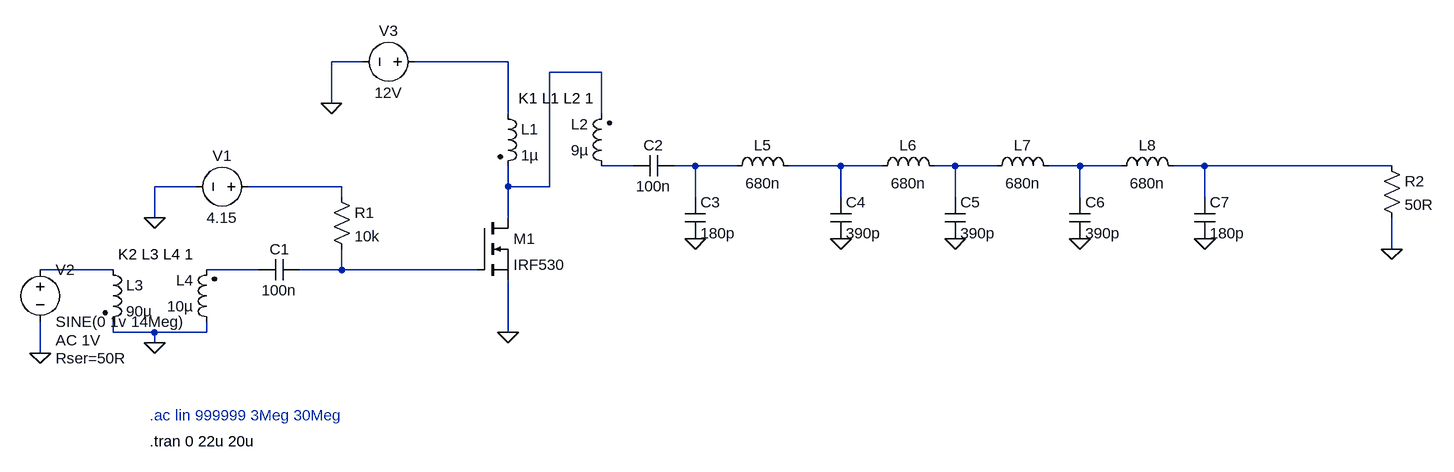
[diagram p0: schematic OUT_RF_AMP.asc]
OUT_RF_AMP.asc, the LTspice schematic file:
Version 4
SHEET 1 2644 680
WIRE -240 -352 -288 -352
WIRE -16 -352 -160 -352
WIRE 128 -336 48 -336
WIRE -288 -288 -288 -352
WIRE -16 -272 -16 -352
WIRE 128 -272 128 -336
WIRE 176 -192 128 -192
WIRE 272 -192 240 -192
WIRE 336 -192 272 -192
WIRE 496 -192 416 -192
WIRE 560 -192 496 -192
WIRE 672 -192 640 -192
WIRE 736 -192 672 -192
WIRE 864 -192 816 -192
WIRE 928 -192 864 -192
WIRE 1056 -192 1008 -192
WIRE 1344 -192 1056 -192
WIRE -496 -160 -560 -160
WIRE -272 -160 -416 -160
WIRE -16 -160 -16 -192
WIRE 48 -160 48 -336
WIRE 48 -160 -16 -160
WIRE -272 -144 -272 -160
WIRE 272 -144 272 -192
WIRE 496 -144 496 -192
WIRE 672 -144 672 -192
WIRE 864 -144 864 -192
WIRE 1056 -144 1056 -192
WIRE -560 -112 -560 -160
WIRE -16 -112 -16 -160
WIRE 1344 -64 1344 -112
WIRE -624 -32 -736 -32
WIRE -400 -32 -480 -32
WIRE -272 -32 -272 -64
WIRE -272 -32 -336 -32
WIRE -64 -32 -272 -32
WIRE -624 64 -624 48
WIRE -560 64 -624 64
WIRE -480 64 -480 48
WIRE -480 64 -560 64
WIRE -16 64 -16 -16
WIRE -560 80 -560 64
WIRE -736 96 -736 48
FLAG -16 64 0
FLAG -560 -112 0
FLAG -288 -288 0
FLAG -560 80 0
FLAG 1344 -64 0
FLAG 272 -80 0
FLAG 496 -80 0
FLAG 672 -80 0
FLAG 864 -80 0
FLAG 1056 -80 0
FLAG -736 96 0
SYMBOL nmos -64 -112 R0
SYMATTR InstName M1
SYMATTR Value IRF530
SYMBOL cap -336 -48 R90
WINDOW 0 0 32 VBottom 2
WINDOW 3 32 32 VTop 2
SYMATTR InstName C1
SYMATTR Value 100n
SYMBOL res -288 -160 R0
SYMATTR InstName R1
SYMATTR Value 10k
SYMBOL voltage -400 -160 R90
WINDOW 0 -32 56 VBottom 2
WINDOW 3 32 56 VTop 2
WINDOW 123 0 0 Left 0
WINDOW 39 0 0 Left 0
SYMATTR InstName V1
SYMATTR Value 4.15
SYMBOL ind2 -32 -288 R0
SYMATTR InstName L1
SYMATTR Value 1µ
SYMATTR Type ind
SYMBOL voltage -144 -352 R90
WINDOW 0 -32 56 VBottom 2
WINDOW 3 32 56 VTop 2
WINDOW 123 0 0 Left 0
WINDOW 39 0 0 Left 0
SYMATTR InstName V3
SYMATTR Value 12V
SYMBOL ind2 144 -176 R180
WINDOW 0 36 80 Left 2
WINDOW 3 36 40 Left 2
SYMATTR InstName L2
SYMATTR Value 9µ
SYMATTR Type ind
SYMBOL cap 240 -208 R90
WINDOW 0 0 32 VBottom 2
WINDOW 3 32 32 VTop 2
SYMATTR InstName C2
SYMATTR Value 100n
SYMBOL ind2 -640 -48 R0
SYMATTR InstName L3
SYMATTR Value 90µ
SYMATTR Type ind
SYMATTR SpiceLine Rser=0.1r
SYMBOL ind2 -464 64 R180
WINDOW 0 36 80 Left 2
WINDOW 3 36 40 Left 2
SYMATTR InstName L4
SYMATTR Value 10µ
SYMATTR Type ind
SYMBOL res 1328 -208 R0
SYMATTR InstName R2
SYMATTR Value 50R
SYMBOL ind 320 -176 R270
WINDOW 0 32 56 VTop 2
WINDOW 3 5 56 VBottom 2
SYMATTR InstName L5
SYMATTR Value 680n
SYMBOL cap 256 -144 R0
SYMATTR InstName C3
SYMATTR Value 180p
SYMBOL ind 544 -176 R270
WINDOW 0 32 56 VTop 2
WINDOW 3 5 56 VBottom 2
SYMATTR InstName L6
SYMATTR Value 680n
SYMBOL cap 480 -144 R0
SYMATTR InstName C4
SYMATTR Value 390p
SYMBOL ind 720 -176 R270
WINDOW 0 32 56 VTop 2
WINDOW 3 5 56 VBottom 2
SYMATTR InstName L7
SYMATTR Value 680n
SYMBOL cap 656 -144 R0
SYMATTR InstName C5
SYMATTR Value 390p
SYMBOL ind 912 -176 R270
WINDOW 0 32 56 VTop 2
WINDOW 3 5 56 VBottom 2
SYMATTR InstName L8
SYMATTR Value 680n
SYMBOL cap 848 -144 R0
SYMATTR InstName C6
SYMATTR Value 390p
SYMBOL cap 1040 -144 R0
SYMATTR InstName C7
SYMATTR Value 180p
SYMBOL voltage -736 -48 R0
WINDOW 123 24 124 Left 2
WINDOW 39 24 152 Left 2
SYMATTR Value2 AC 1V
SYMATTR SpiceLine Rser=50R
SYMATTR InstName V2
SYMATTR Value SINE(0 1v 14Meg)
TEXT -568 192 Left 2 ;.ac lin 999999 3Meg 30Meg
TEXT 0 -296 Left 2 !K1 L1 L2 1
TEXT -616 -56 Left 2 !K2 L3 L4 1
TEXT -568 232 Left 2 !.tran 0 22u 20u

The netlist it stands for:
* OUT_RF_AMP.asc
M1 N002 N012 0 0 IRF530
C1 N012 N011 100n
R1 N009 N012 10k
V1 N009 0 4.15
L1 N001 N002 1µ
V3 N001 0 12V
L2 N003 N002 9µ
C2 N004 N003 100n
L3 N010 0 90µ Rser=0.1r
L4 0 N011 10µ
R2 N008 0 50R
L5 N004 N005 680n
C3 N004 0 180p
L6 N005 N006 680n
C4 N005 0 390p
L7 N006 N007 680n
C5 N006 0 390p
L8 N007 N008 680n
C6 N007 0 390p
C7 N008 0 180p
V2 N010 0 SINE(0 1v 14Meg) AC 1V Rser=50R
.model NMOS NMOS
.model PMOS PMOS
.lib standard.mos
* .ac lin 999999 3Meg 30Meg
K1 L1 L2 1
K2 L3 L4 1
.tran 0 22u 20u
.backanno
.end